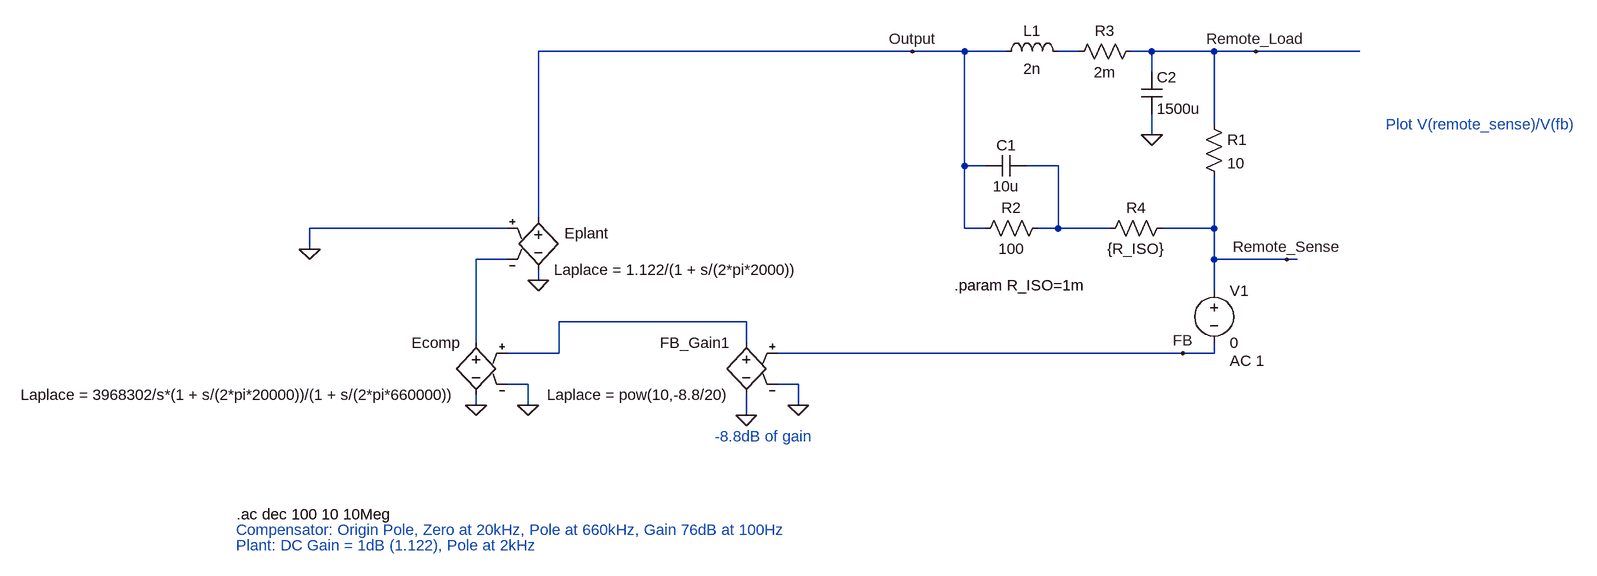
[diagram p0: schematic Classical_Feedback_Example_FrequencyResponse_RemoteLoad.asc]
Classical_Feedback_Example_FrequencyResponse_RemoteLoad.asc, the LTspice schematic file:
Version 4
SHEET 1 2048 680
WIRE 992 -176 416 -176
WIRE 1072 -176 992 -176
WIRE 1136 -176 1072 -176
WIRE 1248 -176 1216 -176
WIRE 1360 -176 1328 -176
WIRE 1456 -176 1360 -176
WIRE 1520 -176 1456 -176
WIRE 1680 -176 1520 -176
WIRE 1360 -144 1360 -176
WIRE 1456 -64 1456 -176
WIRE 1360 -48 1360 -80
WIRE 1072 0 1072 -176
WIRE 1104 0 1072 0
WIRE 1216 0 1168 0
WIRE 416 80 416 -176
WIRE 368 96 64 96
WIRE 1072 96 1072 0
WIRE 1104 96 1072 96
WIRE 1216 96 1216 0
WIRE 1216 96 1184 96
WIRE 1296 96 1216 96
WIRE 1456 96 1456 16
WIRE 1456 96 1376 96
WIRE 64 128 64 96
WIRE 368 144 320 144
WIRE 1456 144 1456 96
WIRE 1568 144 1456 144
WIRE 1584 144 1568 144
WIRE 416 176 416 160
WIRE 1456 192 1456 144
WIRE 736 240 448 240
WIRE 320 272 320 144
WIRE 736 272 736 240
WIRE 448 288 448 240
WIRE 448 288 368 288
WIRE 1408 288 784 288
WIRE 1456 288 1456 272
WIRE 1456 288 1408 288
WIRE 400 336 368 336
WIRE 816 336 784 336
WIRE 320 368 320 352
WIRE 400 368 400 336
WIRE 816 368 816 336
WIRE 736 384 736 352
FLAG 416 176 0
FLAG 992 -176 Output
FLAG 320 368 0
FLAG 400 368 0
FLAG 64 128 0
FLAG 1408 288 FB
FLAG 736 384 0
FLAG 816 368 0
FLAG 1360 -48 0
FLAG 1520 -176 Remote_Load
FLAG 1568 144 Remote_Sense
SYMBOL e 320 256 M0
SYMATTR InstName Ecomp
SYMATTR Value Laplace = 3968302/s*(1 + s/(2*pi*20000))/(1 + s/(2*pi*660000))
SYMBOL e 416 64 R0
WINDOW 0 40 40 Left 2
SYMATTR InstName Eplant
SYMATTR Value Laplace = 1.122/(1 + s/(2*pi*2000))
SYMBOL voltage 1456 176 R0
WINDOW 123 24 124 Left 2
WINDOW 39 0 0 Left 0
SYMATTR Value2 AC 1
SYMATTR InstName V1
SYMATTR Value 0
SYMBOL e 736 256 M0
SYMATTR InstName FB_Gain1
SYMATTR Value Laplace = pow(10,-8.8/20)
SYMBOL res 1440 -80 R0
SYMATTR InstName R1
SYMATTR Value 10
SYMBOL res 1200 80 R90
WINDOW 0 0 56 VBottom 2
WINDOW 3 32 56 VTop 2
SYMATTR InstName R2
SYMATTR Value 100
SYMBOL cap 1168 -16 R90
WINDOW 0 0 32 VBottom 2
WINDOW 3 32 32 VTop 2
SYMATTR InstName C1
SYMATTR Value 10u
SYMBOL ind 1120 -160 R270
WINDOW 0 32 56 VTop 2
WINDOW 3 5 56 VBottom 2
SYMATTR InstName L1
SYMATTR Value 2n
SYMBOL res 1344 -192 R90
WINDOW 0 0 56 VBottom 2
WINDOW 3 32 56 VTop 2
SYMATTR InstName R3
SYMATTR Value 2m
SYMBOL cap 1344 -144 R0
SYMATTR InstName C2
SYMATTR Value 1500u
SYMBOL res 1392 80 R90
WINDOW 0 0 56 VBottom 2
WINDOW 3 32 56 VTop 2
SYMATTR InstName R4
SYMATTR Value {R_ISO}
TEXT -48 536 Left 2 !.ac dec 100 10 10Meg
TEXT -56 560 Left 2 ; Compensator: Origin Pole, Zero at 20kHz, Pole at 660kHz, Gain 76dB at 100Hz
TEXT -56 584 Left 2 ; Plant: DC Gain = 1dB (1.122), Pole at 2kHz
TEXT 688 416 Left 2 ;-8.8dB of gain
TEXT 1720 -64 Left 2 ;Plot V(remote_sense)/V(fb)
TEXT 1056 184 Left 2 !.param R_ISO=1m

The netlist it stands for:
* Classical_Feedback_Example_FrequencyResponse_RemoteLoad.asc
Ecomp N003 0 N004 0 Laplace = 3968302/s*(1 + s/(2*pi*20000))/(1 + s/(2*pi*660000))
Eplant Output 0 0 N003 Laplace = 1.122/(1 + s/(2*pi*2000))
V1 Remote_Sense FB 0 AC 1
E§FB_Gain1 N004 0 FB 0 Laplace = pow(10,-8.8/20)
R1 Remote_Load Remote_Sense 10
R2 N002 Output 100
C1 N002 Output 10u
L1 Output N001 2n
R3 Remote_Load N001 2m
C2 Remote_Load 0 1500u
R4 Remote_Sense N002 {R_ISO}
.ac dec 100 10 10Meg
*  Compensator: Origin Pole, Zero at 20kHz, Pole at 660kHz, Gain 76dB at 100Hz
*  Plant: DC Gain = 1dB (1.122), Pole at 2kHz
* -8.8dB of gain
* Plot V(remote_sense)/V(fb)
.param R_ISO=1m
.backanno
.end